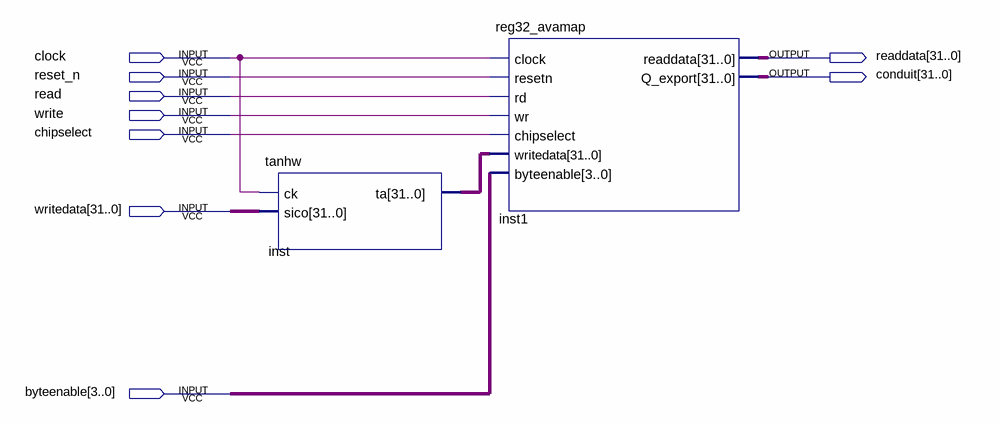
[diagram p0: schematic sheet]
// Quartus schematic hwtan.bdf as structural Verilog: 2 symbols, 9 pins
module hwtan (
  input  clock,
  input  reset_n,
  input  read,
  input  write,
  input  chipselect,
  input  [31:0] writedata,
  input  [3:0] byteenable,
  output [31:0] readdata,
  output [31:0] conduit
);

  wire [31:0] inst_ta;

  tanhw inst (.ck(clock), .sico(writedata), .ta(inst_ta));
  reg32_avamap inst1 (
    .clock(clock), .resetn(reset_n), .rd(read), .wr(write), .chipselect(chipselect), .writedata(inst_ta),
    .byteenable(byteenable), .readdata(readdata), .Q_export(conduit));
endmodule
